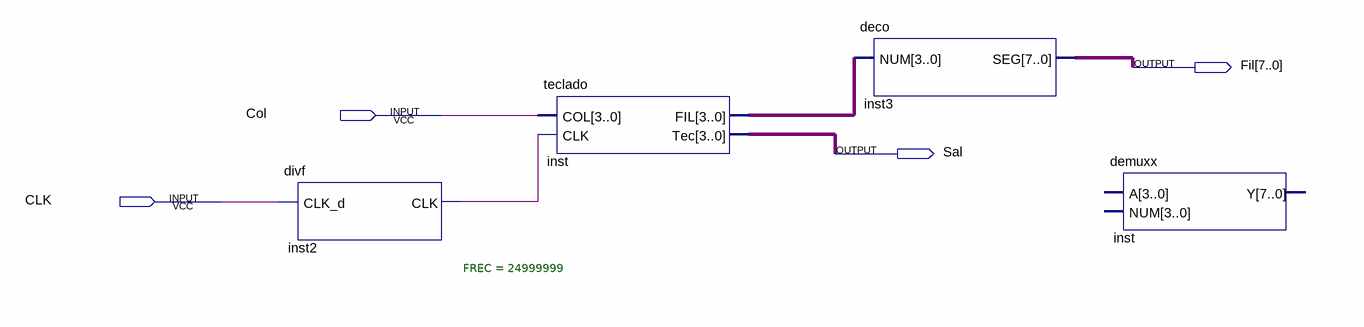
[diagram p0: schematic sheet]
// Quartus schematic teclado.bdf as structural Verilog: 4 symbols, 4 pins
module teclado (
  input  Col,
  input  CLK,
  output [7:0] Fil,
  output Sal
);

  wire inst2_clk;
  wire [3:0] inst_fil, inst_tec;

  divf #(.FREC(24999999)) inst2 (.CLK_d(CLK), .CLK(inst2_clk));
  teclado inst (.COL({4{Col}}), .CLK(inst2_clk), .FIL(inst_fil), .Tec(inst_tec));
  deco inst3 (.NUM(inst_fil), .SEG(Fil));
  demuxx inst_dup2 ();  // open: A, NUM, Y
endmodule
